# EAGLE schematic Joystick (EAGLE 8.7.0)
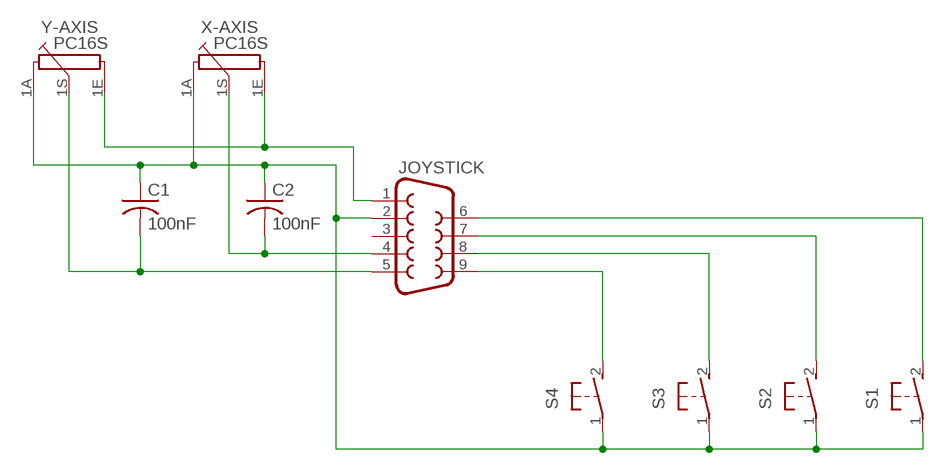
[diagram p0: schematic, sheet 1]

## Parts
C1  100nF  C-US050-025X075  [C050-025X075]
C2  100nF  C-US050-025X075  [C050-025X075]
JOYSTICK  F09V  [F09V]
S1  31-XX  [B3F-31XX]
S2  31-XX  [B3F-31XX]
S3  31-XX  [B3F-31XX]
S4  31-XX  [B3F-31XX]
X-AXIS  PC16S  [PC16S]
Y-AXIS  PC16S  [PC16S]

## Nets
N$2: JOYSTICK.1 X-AXIS.1E Y-AXIS.1E
N$3: C1.1 C2.1 JOYSTICK.2 S1.1(P) S2.1(P) S3.1(P) S4.1(P) X-AXIS.1A Y-AXIS.1A
N$31: C2.2 JOYSTICK.4 X-AXIS.1S
N$32: C1.2 JOYSTICK.5 Y-AXIS.1S
N$33: JOYSTICK.9 S4.2(S)
N$35: JOYSTICK.8 S3.2(S)
N$36: JOYSTICK.7 S2.2(S)
N$37: JOYSTICK.6 S1.2(S)
Unconnected: JOYSTICK.3

## Library data of the parts
C1 C2 = resistor:C-US: CAPACITOR, American symbol
JOYSTICK = con-subd:F09: SUB-D; OC_FARNELL: unknown; OC_NEWARK: unknown
S1-S4 = switch-omron:31-XX: OMRON SWITCH; MPN: B3F-3100; OC_FARNELL: 959704; OC_NEWARK: 36M3582
X-AXIS Y-AXIS = piher:PC16S: POTENTIOMETER single carbon potentiometer, 16 mm, S3ROH; OC_FARNELL: 4452940; OC_NEWARK: unknown